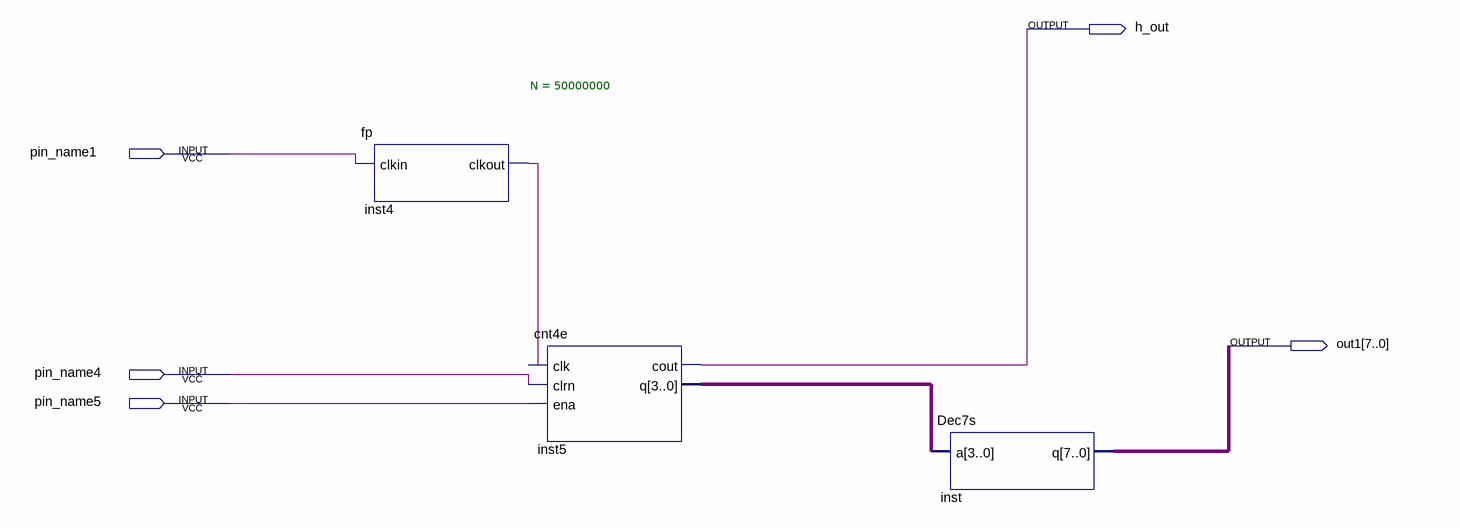
[diagram p0: schematic sheet]
// Quartus schematic Block4.bdf as structural Verilog: 3 symbols, 5 pins
module Block4 (
  input  pin_name1,
  input  pin_name4,
  input  pin_name5,
  output h_out,
  output [7:0] out1
);

  wire inst4_clkout;
  wire [3:0] inst5_q;

  fp #(.N(50000000)) inst4 (.clkin(pin_name1), .clkout(inst4_clkout));
  cnt4e inst5 (.clrn(pin_name4), .ena(pin_name5), .cout(h_out), .q(inst5_q));  // open: clk
  Dec7s inst (.a(inst5_q), .q(out1));
endmodule
